# Altium schematic sheet 08_RK3128_Flash_SDMMC.SchDoc
size 297 x 209 mm
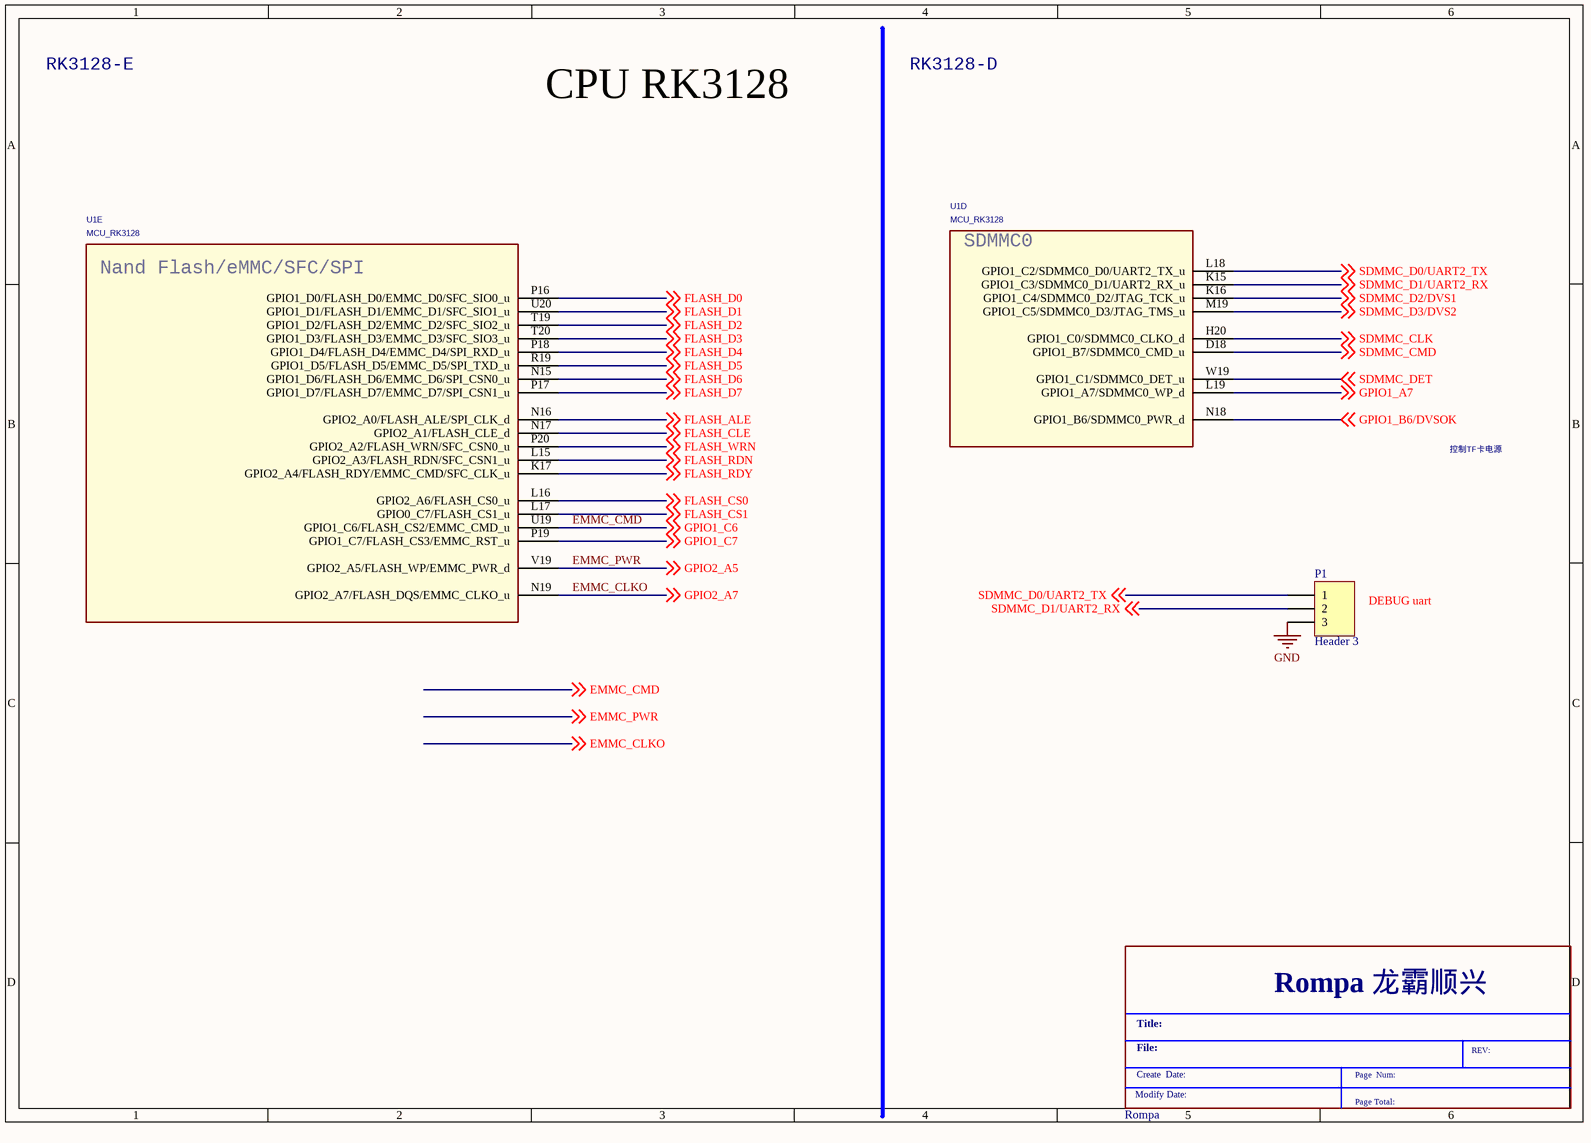
[diagram p0: 08_RK3128_Flash_SDMMC.SchDoc]

## Parts
*  Rompa  (graphical)
P1  Header 3  [HDR1X3]
U1  MCU_RK3128  [BGA316-14X14-0.65]  (parts D,E of 12)

## Nets
GND: P1.3
EMMC_CLKO: U1.N19(GPIO2_A7/FLASH_DQS/EMMC_CLKO_u) ; off-sheet GPIO2_A7, off-sheet EMMC_CLKO  [also labelled GPIO2_A7]
EMMC_CMD: U1.U19(GPIO1_C6/FLASH_CS2/EMMC_CMD_u) ; off-sheet GPIO1_C6, off-sheet EMMC_CMD  [also labelled GPIO1_C6]
EMMC_PWR: U1.V19(GPIO2_A5/FLASH_WP/EMMC_PWR_d) ; off-sheet GPIO2_A5, off-sheet EMMC_PWR  [also labelled GPIO2_A5]
FLASH_ALE: U1.N16(GPIO2_A0/FLASH_ALE/SPI_CLK_d) ; off-sheet FLASH_ALE
FLASH_CLE: U1.N17(GPIO2_A1/FLASH_CLE_d) ; off-sheet FLASH_CLE
FLASH_CS0: U1.L16(GPIO2_A6/FLASH_CS0_u) ; off-sheet FLASH_CS0
FLASH_CS1: U1.L17(GPIO0_C7/FLASH_CS1_u) ; off-sheet FLASH_CS1
FLASH_D0: U1.P16(GPIO1_D0/FLASH_D0/EMMC_D0/SFC_SIO0_u) ; off-sheet FLASH_D0
FLASH_D1: U1.U20(GPIO1_D1/FLASH_D1/EMMC_D1/SFC_SIO1_u) ; off-sheet FLASH_D1
FLASH_D2: U1.T19(GPIO1_D2/FLASH_D2/EMMC_D2/SFC_SIO2_u) ; off-sheet FLASH_D2
FLASH_D3: U1.T20(GPIO1_D3/FLASH_D3/EMMC_D3/SFC_SIO3_u) ; off-sheet FLASH_D3
FLASH_D4: U1.P18(GPIO1_D4/FLASH_D4/EMMC_D4/SPI_RXD_u) ; off-sheet FLASH_D4
FLASH_D5: U1.R19(GPIO1_D5/FLASH_D5/EMMC_D5/SPI_TXD_u) ; off-sheet FLASH_D5
FLASH_D6: U1.N15(GPIO1_D6/FLASH_D6/EMMC_D6/SPI_CSN0_u) ; off-sheet FLASH_D6
FLASH_D7: U1.P17(GPIO1_D7/FLASH_D7/EMMC_D7/SPI_CSN1_u) ; off-sheet FLASH_D7
FLASH_RDN: U1.L15(GPIO2_A3/FLASH_RDN/SFC_CSN1_u) ; off-sheet FLASH_RDN
FLASH_RDY: U1.K17(GPIO2_A4/FLASH_RDY/EMMC_CMD/SFC_CLK_u) ; off-sheet FLASH_RDY
FLASH_WRN: U1.P20(GPIO2_A2/FLASH_WRN/SFC_CSN0_u) ; off-sheet FLASH_WRN
GPIO1_A7: U1.L19(GPIO1_A7/SDMMC0_WP_d) ; off-sheet GPIO1_A7
GPIO1_B6/DVSOK: U1.N18(GPIO1_B6/SDMMC0_PWR_d) ; off-sheet GPIO1_B6/DVSOK
GPIO1_C7: U1.P19(GPIO1_C7/FLASH_CS3/EMMC_RST_u) ; off-sheet GPIO1_C7
SDMMC_CLK: U1.H20(GPIO1_C0/SDMMC0_CLKO_d) ; off-sheet SDMMC_CLK
SDMMC_CMD: U1.D18(GPIO1_B7/SDMMC0_CMD_u) ; off-sheet SDMMC_CMD
SDMMC_D0/UART2_TX: P1.1 U1.L18(GPIO1_C2/SDMMC0_D0/UART2_TX_u) ; off-sheet SDMMC_D0/UART2_TX
SDMMC_D1/UART2_RX: P1.2 U1.K15(GPIO1_C3/SDMMC0_D1/UART2_RX_u) ; off-sheet SDMMC_D1/UART2_RX
SDMMC_D2/DVS1: U1.K16(GPIO1_C4/SDMMC0_D2/JTAG_TCK_u) ; off-sheet SDMMC_D2/DVS1
SDMMC_D3/DVS2: U1.M19(GPIO1_C5/SDMMC0_D3/JTAG_TMS_u) ; off-sheet SDMMC_D3/DVS2
SDMMC_DET: U1.W19(GPIO1_C1/SDMMC0_DET_u) ; off-sheet SDMMC_DET

## Notes on the sheet
- RK3128-E
- RK3128-D
- CPU RK3128
- 控制TF卡电源
- DEBUG uart
- (in symbol MCU_RK3128, part D) SDMMC0
- (in symbol MCU_RK3128, part E) Nand Flash/eMMC/SFC/SPI
- (in symbol Rompa) Rompa 龙霸顺兴; Title:; File:; REV:; Create  Date:; Page  Num:; Modify Date:; Page Total:

## Library data of the parts
P1 = Header 3: Header, 3-Pin Debug Uart; LatestRevisionDate: 17-Jul-2002; LatestRevisionNote: Re-released for DXP Platform.; Publisher: Altium Limited